# EAGLE design OpAmp (EAGLE 8.3.1)
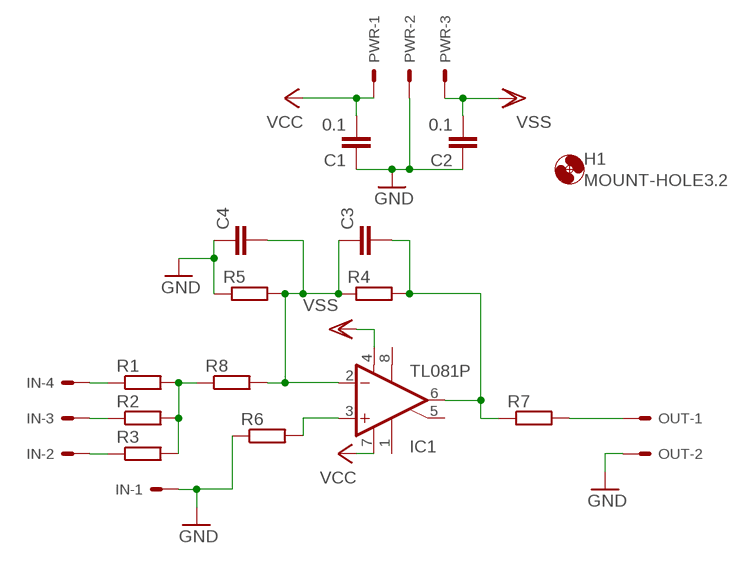
[diagram p0: schematic, sheet 1]

## Parts
C1  0.1  C-EU050-030X075  [C050-030X075]
C2  0.1  C-EU050-030X075  [C050-030X075]
C3  C-EU050-030X075  [C050-030X075]
C4  C-EU050-030X075  [C050-030X075]
H1  MOUNT-HOLE3.2  [3,2]
IC1  TL081P  [DIL08]
IN  22-27-2041-04  [6410-04]
OUT  22-27-2021-02  [6410-02]
PWR  22-27-2031-03  [6410-03]
R1  R-EU_0204/7  [0204/7]
R2  R-EU_0204/7  [0204/7]
R3  R-EU_0204/7  [0204/7]
R4  R-EU_0204/7  [0204/7]
R5  R-EU_0204/7  [0204/7]
R6  R-EU_0204/7  [0204/7]
R7  R-EU_0204/7  [0204/7]
R8  R-EU_0204/7  [0204/7]

## Nets
GND: C1.1 C2.1 C4.1 IN.1 OUT.2 PWR.2 R5.1 R6.1
N$1: IN.4 R1.1
N$2: IN.3 R2.1
N$3: IN.2 R3.1
N$4: C3.1 C4.2 IC1.2(-IN) R4.1 R5.2 R8.2
N$5: C3.2 IC1.6(OUT) R4.2 R7.1
N$6: OUT.1 R7.2
N$7: IC1.3(+IN) R6.2
N$8: R1.2 R2.2 R3.2 R8.1
VCC: C1.2 IC1.7(V+) PWR.1
VSS: C2.2 IC1.4(V-) PWR.3
Unconnected: IC1.1(ON1) IC1.5(ON2) IC1.8(OPT)

## Library data of the parts
C1-C4 = rcl:C-EU: CAPACITOR, European symbol
H1 = holes:MOUNT-HOLE: MOUNTING HOLE with drill center marker
IC1 = linear:TL081: OP AMP
IN = con-molex:22-?-04: CONNECTOR wire to board 2.54 mm (.1 inch) pitch header; OC_FARNELL: unknown; OC_NEWARK: unknown
OUT = con-molex:22-?-02: CONNECTOR wire to board 2.54 mm (.1 inch) pitch header; OC_FARNELL: unknown; OC_NEWARK: unknown
PWR = con-molex:22-?-03: CONNECTOR wire to board 2.54 mm (.1 inch) pitch header; OC_FARNELL: unknown; OC_NEWARK: unknown
R1-R8 = rcl:R-EU_: RESISTOR, European symbol

## Board
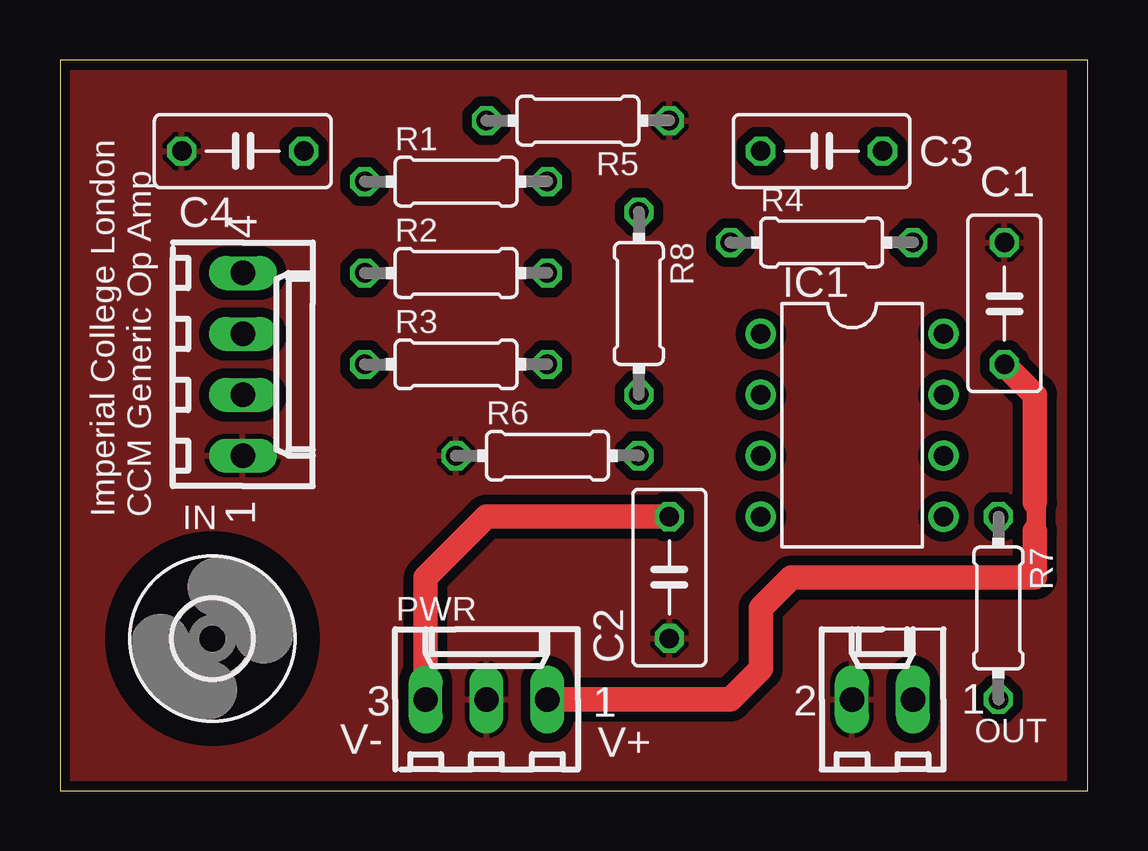
[diagram p1: board, top side]
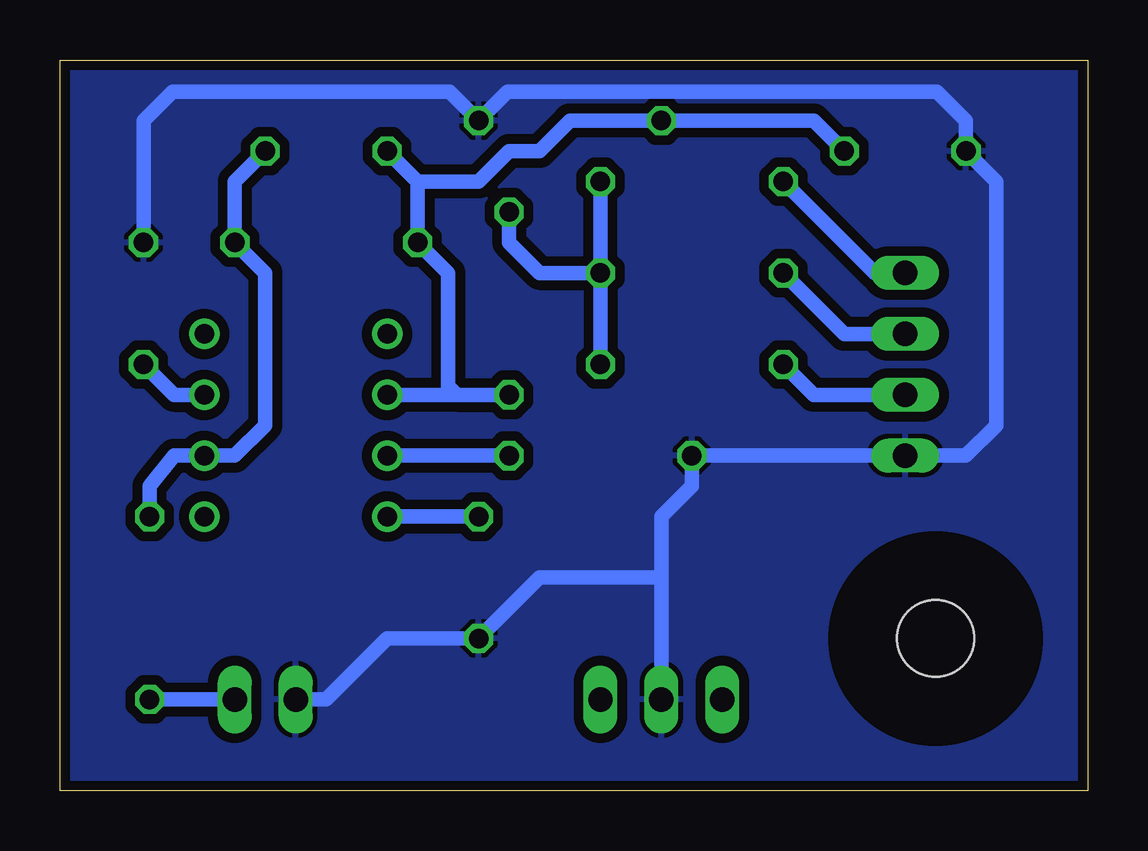
[diagram p2: board, bottom side, seen from below]

Size 42.85 x 30.47 mm. Coordinates in mm from the lower left corner, seen from the top.
Outline: 0,0 42.85,0 42.85,30.47 0,30.47 0,0
Copper layers (1*16): Top 0.035mm / dielectric 1.5mm / Bottom 0.035mm
Design rules "PCB-POOL Standard": minimum track width 0.15mm, minimum drill 0.3mm, track to track 0.15mm, track to pad 0.15mm, pad to pad 0.15mm, via to via 0.15mm, smd to smd 0.15mm, copper to edge 0.3mm, drill to drill 0.2mm, minimum pad ring 0.2mm, minimum via ring 0.15mm, stop-mask expansion 0.075mm, vias tented up to drill 0mil, thermal gap 0.2mm

### Footprints (pad centres in the part's own frame; a part is rotated, then mirrored left to right if it is on the bottom)
C050-030X075 = drill 0.813 octagon: 1 -2.54,0; 2 2.54,0
3,2 = hole 3.2: 0,0
DIL08 = drill 0.813 pad 1.27: 1 -3.81,-3.81; 2 -1.27,-3.81; 3 1.27,-3.81; 4 3.81,-3.81; 5 3.81,3.81; 6 1.27,3.81; 7 -1.27,3.81; 8 -3.81,3.81
6410-04 = drill 1.016 long: 1 3.81,0; 2 1.27,0; 3 -1.27,0; 4 -3.81,0
6410-02 = drill 1.016 long: 1 1.27,0; 2 -1.27,0
6410-03 = drill 1.016 long: 1 2.54,0; 2 0,0; 3 -2.54,0
0204/7 = drill 0.813 octagon: 1 -3.81,0; 2 3.81,0

### Placement (x,y rotation side)
C1  39.37,20.32 270 top
C2  25.4,8.89 90 top
C3  31.75,26.67 0 top
C4  7.62,26.67 0 top
H1  6.35,6.35 0 top
IC1  33.02,15.24 270 top
IN  7.62,17.78 270 top
OUT  34.29,3.81 0 top
PWR  17.78,3.81 0 top
R1  16.51,25.4 0 top
R2  16.51,21.59 0 top
R3  16.51,17.78 0 top
R4  31.75,22.86 0 top
R5  21.59,27.94 180 top
R6  20.32,13.97 0 top
R7  39.12,7.62 270 top
R8  24.13,20.32 270 top

### Tracks (layer width: path | path; a pad name or v marks a point on that pad's centre or on a via)
GND
  Bottom 0.61: 4.88,26.47 3.81,25.4 3.81,15.24 5.08,13.97 IN.1 R6.1 16.51,12.7 17.78,11.43 17.78,8.71 | 4.88,26.47 C4.1 | 17.78,8.71 PWR.2 | C4.1 5.08,27.94 6.29,29.15 24.19,29.15 R5.1 26.61,29.15 38.16,29.15 39.37,27.94 C1.1 | C4.1 4.88,26.47 | OUT.2 31.75,3.81 29.21,6.35 C2.1 22.86,8.89 17.96,8.89 17.78,8.71
  pour Bottom (isolate 0.406): 0,0 0,30.48 42.42,30.61 42.42,0.13
  pour Top (isolate 0.406): 0,0 0,30.48 41.91,30.48 41.91,0
N$1
  Bottom 0.61: IN.4 8.89,21.59 R1.1
N$2
  Bottom 0.61: IN.3 10.16,19.05 R2.1
N$3
  Bottom 0.61: IN.2 11.43,16.51 R3.1
N$4
  Bottom 0.61: C4.2 11.43,27.94 R5.2 21.59,27.94 22.86,26.67 24.13,26.67 25.4,25.4 27.94,25.4 | 26.3,16.51 IC1.2 | 26.3,16.51 R8.2 | 26.3,16.51 26.67,16.88 26.67,21.59 R4.1 27.94,25.4 | 28.02,25.48 C3.1 | 28.02,25.48 27.94,25.4 | 27.94,25.4 28.02,25.48
N$5
  Bottom 0.61: C3.2 35.56,25.4 R4.2 34.29,21.59 34.29,15.24 35.56,13.97 IC1.6 38.1,13.97 39.12,12.7 R7.1
N$6
  Bottom 0.61: R7.2 OUT.1
N$7
  Bottom 0.61: IC1.3 R6.2
N$8
  Bottom 0.61: 20.32,21.6 R1.2 | 20.32,21.6 R2.2 R3.2 | R8.1 24.13,22.86 22.86,21.59 20.33,21.59 20.32,21.6
VCC
  Top 0.813: 40.64,10.83 40.69,10.88 40.69,11.98 40.64,12.03
  Top 1.016: PWR.1 27.94,3.81 29.21,5.08 29.21,7.62 30.48,8.89 40.64,8.89 40.64,10.83 | 40.64,12.03 40.64,16.51 C1.2
  Bottom 0.61: C1.2 38.1,16.51 IC1.7
VSS
  Top 1.016: PWR.3 15.24,8.89 17.78,11.43 C2.2
  Bottom 0.61: IC1.4 C2.2

### Text on the board
tNames: Imperial College London / CCM Generic Op Amp | V- | V+